# EAGLE schematic schematic (EAGLE 9.6.2)
IGNORE_RENUMBER: TP
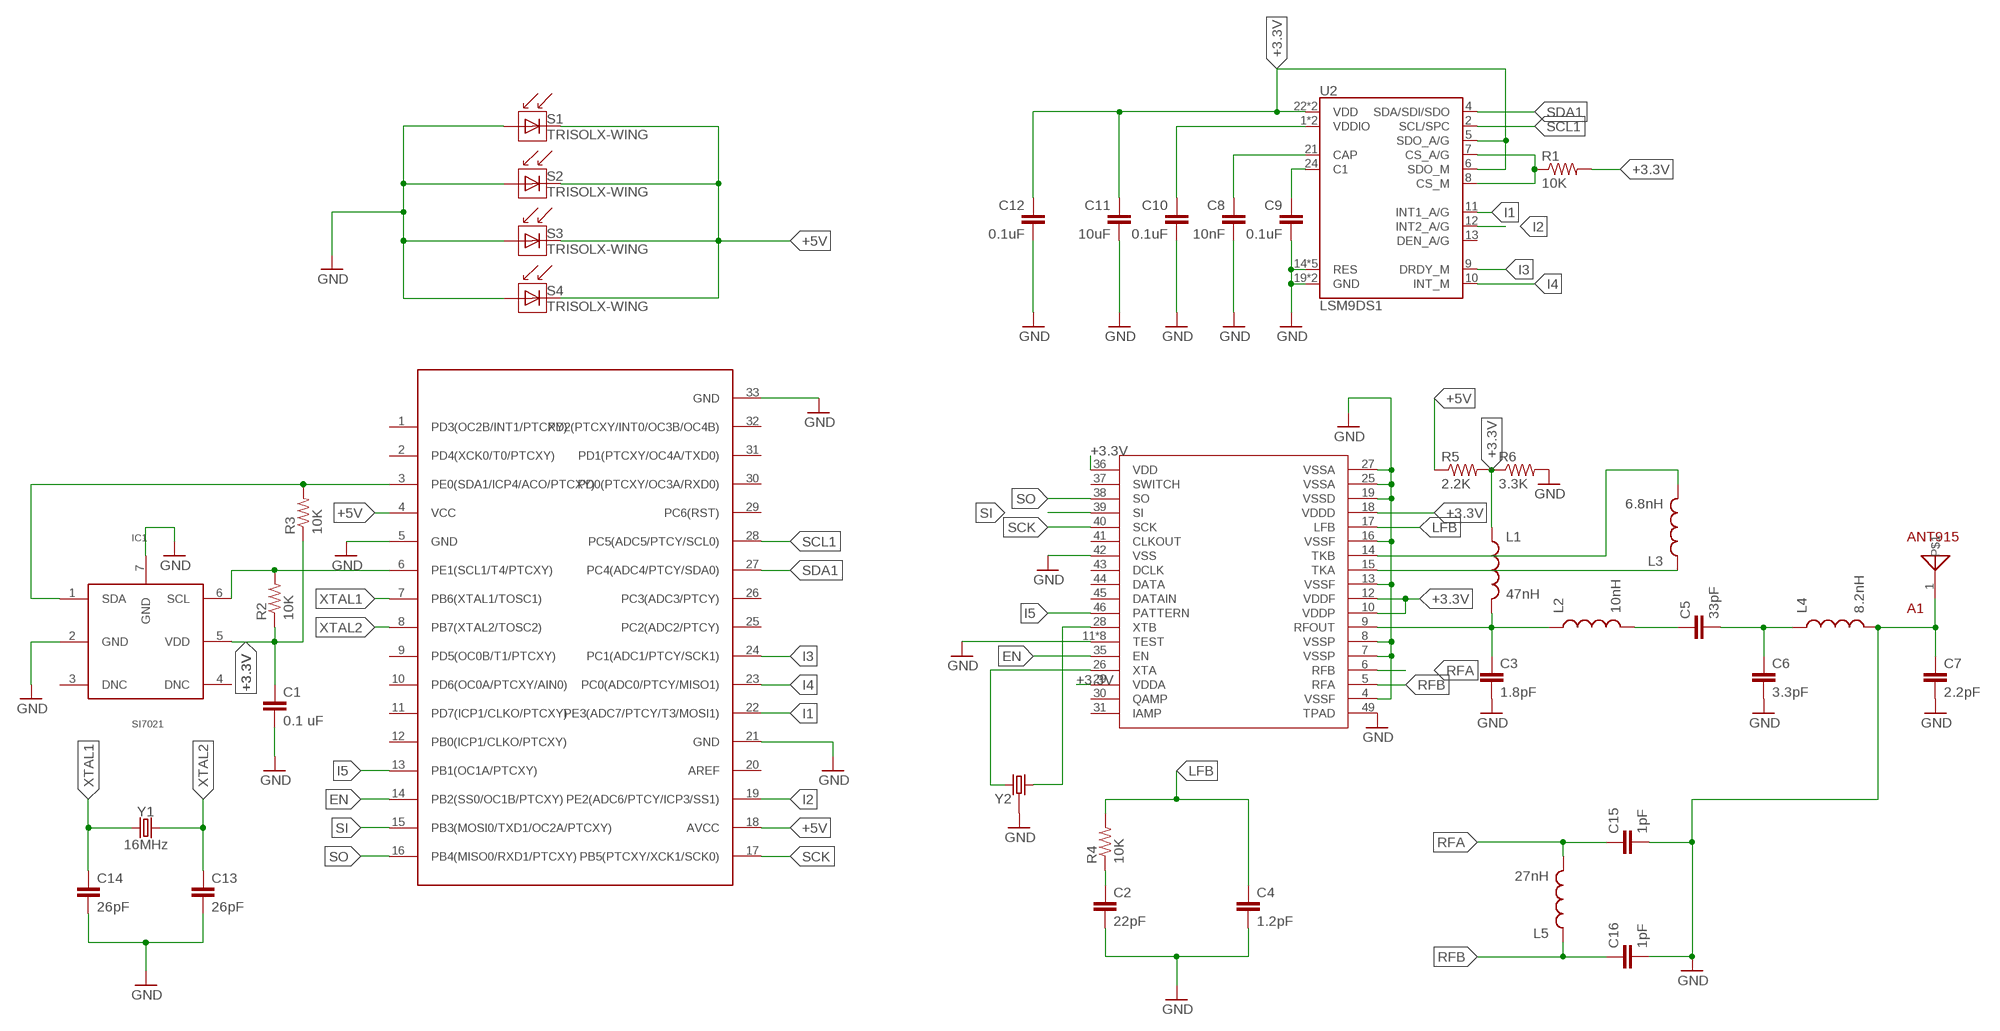
[diagram p0: schematic, sheet 1]

## Parts
A1  ANT915  [ANT915]
C1  0.1 uF  CAP0603-CAP  [0603-CAP]
C2  22pF  CAP0603-CAP  [0603-CAP]
C3  1.8pF  CAP0603-CAP  [0603-CAP]
C4  1.2pF  CAP0603-CAP  [0603-CAP]
C5  33pF  CAP0603-CAP  [0603-CAP]
C6  3.3pF  CAP0603-CAP  [0603-CAP]
C7  2.2pF  CAP0603-CAP  [0603-CAP]
C8  10nF  CAP0603-CAP  [0603-CAP]
C9  0.1uF  CAP0603-CAP  [0603-CAP]
C10  0.1uF  CAP0603-CAP  [0603-CAP]
C11  10uF  CAP0603-CAP  [0603-CAP]
C12  0.1uF  CAP0603-CAP  [0603-CAP]
C13  26pF  CAP0603-CAP  [0603-CAP]
C14  26pF  CAP0603-CAP  [0603-CAP]
C15  1pF  CAP0603-CAP  [0603-CAP]
C16  1pF  CAP0603-CAP  [0603-CAP]
IC1  SI7021  [SI7021]
IC2  ATMEGA328-PB  [ATMEGA328-PB]
IC3  XE1203F  [XE1203F]
L1  47nH  INDUCTOR0603  [0603]
L2  10nH  INDUCTOR0603  [0603]
L3  6.8nH  INDUCTOR0603  [0603]
L4  8.2nH  INDUCTOR0603  [0603]
L5  27nH  INDUCTOR0603  [0603]
R1  10K  RESISTOR0603-RES  [0603-RES]
R2  10K  RESISTOR0603-RES  [0603-RES]
R3  10K  RESISTOR0603-RES  [0603-RES]
R4  10K  RESISTOR0603-RES  [0603-RES]
R5  2.2K  RESISTOR0603-RES  [0603-RES]
R6  3.3K  RESISTOR0603-RES  [0603-RES]
S1  TRISOLX-WING  [TRISOLX-T01]
S2  TRISOLX-WING  [TRISOLX-T01]
S3  TRISOLX-WING  [TRISOLX-T01]
S4  TRISOLX-WING  [TRISOLX-T01]
U2  LSM9DS1  [LGA24-8X4]
Y1  16MHz  CRYSTAL-16MHZSMD-2X1.6  [CRYSTAL-SMD-2.0X1.6MM]
Y2  CRYSTAL-26MHZSMD-3.2X2.5  [CRYSTAL-SMD-3.2X2.5MM]

## Nets
+3.3V: C1.1 C11.1 C12.1 IC1.5(VDD) IC3.10(VDDP) IC3.12(VDDF) IC3.18(VDDD) IC3.29(VDDA) IC3.36(VDD) L1.1 R1.2 R2.1 R3.1 R5.2 R6.1 U2.5(SDO_A/G) U2.6(SDO_M) U2.22(VDD) U2.23(VDD)
+5V: IC2.4(VCC) IC2.18(AVCC) R5.1 S1.P$2(C) S2.P$2(C) S3.P$2(C) S4.P$2(C)
EN: IC2.14(PB2(SS0/OC1B/PTCXY)) IC3.35(EN)
GND: A1.1 C1.2 C2.2 C3.2 C4.2 C6.2 C7.1 C7.2 C8.2 C9.2 C10.2 C11.2 C12.2 C13.2 C14.2 C15.2 C16.2 IC1.2(GND) IC1.7(GND) IC2.5(GND) IC2.21(GND) IC2.33(GND) IC3.4(VSSF) IC3.7(VSSP) IC3.8(VSSP) IC3.11(TEST) IC3.13(VSSF) IC3.16(VSSF) IC3.19(VSSD) IC3.20(TEST) IC3.21(TEST) IC3.23(TEST) IC3.24(TEST) IC3.25(VSSA) IC3.27(VSSA) IC3.32(TEST) IC3.33(TEST) IC3.34(TEST) IC3.42(VSS) IC3.49(TPAD) L4.2 R6.2 S1.P$3(A) S2.P$3(A) S3.P$3(A) S4.P$3(A) U2.14(RES) U2.15(RES) U2.16(RES) U2.17(RES) U2.18(RES) U2.19(GND) U2.20(GND) Y2.2(GND) Y2.4(GND)
I1: IC2.22(PE3(ADC7/PTCY/T3/MOSI1)) U2.11(INT1_A/G)
I2: IC2.19(PE2(ADC6/PTCY/ICP3/SS1)) U2.12(INT2_A/G)
I3: IC2.24(PC1(ADC1/PTCY/SCK1)) U2.9(DRDY_M)
I4: IC2.23(PC0(ADC0/PTCY/MISO1)) U2.10(INT_M)
I5: IC2.13(PB1(OC1A/PTCXY)) IC3.46(PATTERN)
LFB: C4.1 IC3.17(LFB) R4.2
N$1: C2.1 R4.1
N$2: C3.1 IC3.9(RFOUT) L1.2 L2.1
N$3: IC3.14(TKB) L3.2
N$4: C5.1 L2.2
N$5: R1.1 U2.7(CS_A/G) U2.8(CS_M)
N$6: C5.2 C6.1 L4.1
N$8: C8.1 U2.21(CAP)
N$9: C10.1 U2.1(VDDIO) U2.3(VDDIO)
N$10: IC3.15(TKA) L3.1
N$12: IC3.26(XTA) Y2.1
N$13: IC3.28(XTB) Y2.3
N$17: C9.1 U2.24(C1)
RFA: C15.1 IC3.6(RFB) L5.2
RFB: C16.1 IC3.5(RFA) L5.1
SCK: IC2.17(PB5(PTCXY/XCK1/SCK0)) IC3.40(SCK)
SCL: IC1.6(SCL) IC2.6(PE1(SCL1/T4/PTCXY)) R2.2
SCL1: IC2.28(PC5(ADC5/PTCY/SCL0)) U2.2(SCL/SPC)
SDA: IC1.1(SDA) IC2.3(PE0(SDA1/ICP4/ACO/PTCXY)) R3.2
SDA1: IC2.27(PC4(ADC4/PTCY/SDA0)) U2.4(SDA/SDI/SDO)
SI: IC2.15(PB3(MOSI0/TXD1/OC2A/PTCXY)) IC3.39(SI)
SO: IC2.16(PB4(MISO0/RXD1/PTCXY)) IC3.38(SO)
XTAL1: C14.1 IC2.7(PB6(XTAL1/TOSC1)) Y1.1
XTAL2: C13.1 IC2.8(PB7(XTAL2/TOSC2)) Y1.3
Unconnected: IC1.3(DNC) IC1.4(DNC) IC2.1(PD3(OC2B/INT1/PTCXY)) IC2.2(PD4(XCK0/T0/PTCXY)) IC2.9(PD5(OC0B/T1/PTCXY)) IC2.10(PD6(OC0A/PTCXY/AIN0)) IC2.11(PD7(ICP1/CLKO/PTCXY)) IC2.12(PB0(ICP1/CLKO/PTCXY)) IC2.20(AREF) IC2.25(PC2(ADC2/PTCY)) IC2.26(PC3(ADC3/PTCY)) IC2.29(PC6(RST)) IC2.30(PD0(PTCXY/OC3A/RXD0)) IC2.31(PD1(PTCXY/OC4A/TXD0)) IC2.32(PD2(PTCXY/INT0/OC3B/OC4B)) IC3.30(QAMP) IC3.31(IAMP) IC3.37(SWITCH) IC3.41(CLKOUT) IC3.43(DCLK) IC3.44(DATA) IC3.45(DATAIN) U2.13(DEN_A/G)

## Library data of the parts
A1 = Mini-Project:ANT915
C1-C16 = SparkFun:CAP: Capacitor Standard 0603 ceramic capacitor, and 0.1" leaded capacitor.
IC1 = Mini-Project:SI7021
IC2 = Mini-Project:ATMEGA328-PB
IC3 = Mini-Project:XE1203F
L1-L5 = SparkFun:INDUCTOR: Inductors Basic Inductor/Choke - 0603 and 1206. Footprints are not proven and vary greatly between part numbers.
R1-R6 = SparkFun:RESISTOR: Resistor Basic schematic elements and footprints for 0603, 1206, and PTH resistors.
S1-S4 = TriSolX_QzQube:TRISOLX-WING
U2 = LSM9DS1:LSM9DS1: LSM9DS1 3D accelerometer, gyroscope & magnetometer The LSM9DS1 is a system-in-package featuring a 3D digital linear acceleration sensor, a 3D digital angular rate sensor, and a 3D digital magnetic sensor. The LSM9DS1 has a linear acceleration full scale of ±2g/±4g/±8/±16 g, a magnetic field full scale of ±4/±8/±12/±16 gauss and an angular rate of ±245/±500/±2000 dps. The LSM9DS1 includes an I2 C serial bus interface supporting standard and fast mode (100 kHz and 400 kHz) and an SPI serial standard interface. Magnetic, accelerometer and gyroscope sensing can be enabled or set in power-down mode separately for smart power management. The LSM9DS1 is available in a plastic land grid array package (LGA) and it is guaranteed to operate over an extended temperature range from -40 °C to +85 °C.; PROD_ID: IC-12536
Y1 = SparkFun-Clocks:CRYSTAL-16MHZ: 16MHz Crystal Digikey Example <http://www.digikey.com/product-search/en?keywords=535-9122-1-ND> Frequency: 16MHz Frequency Stability: ±50ppm Frequency Tolerance: ±20ppm Load Capacitance: 18pF SparkFun Products: Pro Micro -5V/16MHz <https://www.sparkfun.com/products/12640> SparkFun Serial Enabled LCD Kit <https://www.sparkfun.com/products/10097>; PROD_ID: XTAL-14681
Y2 = SparkFun-Clocks:CRYSTAL-26MHZ: 26MHz Crystal w/ Ground Pin Digikey Example <http://www.digikey.com/product-detail/en/epson/TSX-3225%2026.0000MF09Z-AC3/SER3627CT-ND/1802878> Frequency: 26MHz Frequency Stability: ±9ppm Frequency Tolerance: ±10ppm Load Capacitance: 9pF SparkFun Products: SparkFun ESP32 Thing <https://www.sparkfun.com/products/13907> SparkFun ESP8266 Thing Dev Board <https://www.sparkfun.com/products/13711>; PROD_ID: XTAL-12454